# Altium project SolderingStation2024.PrjPcb
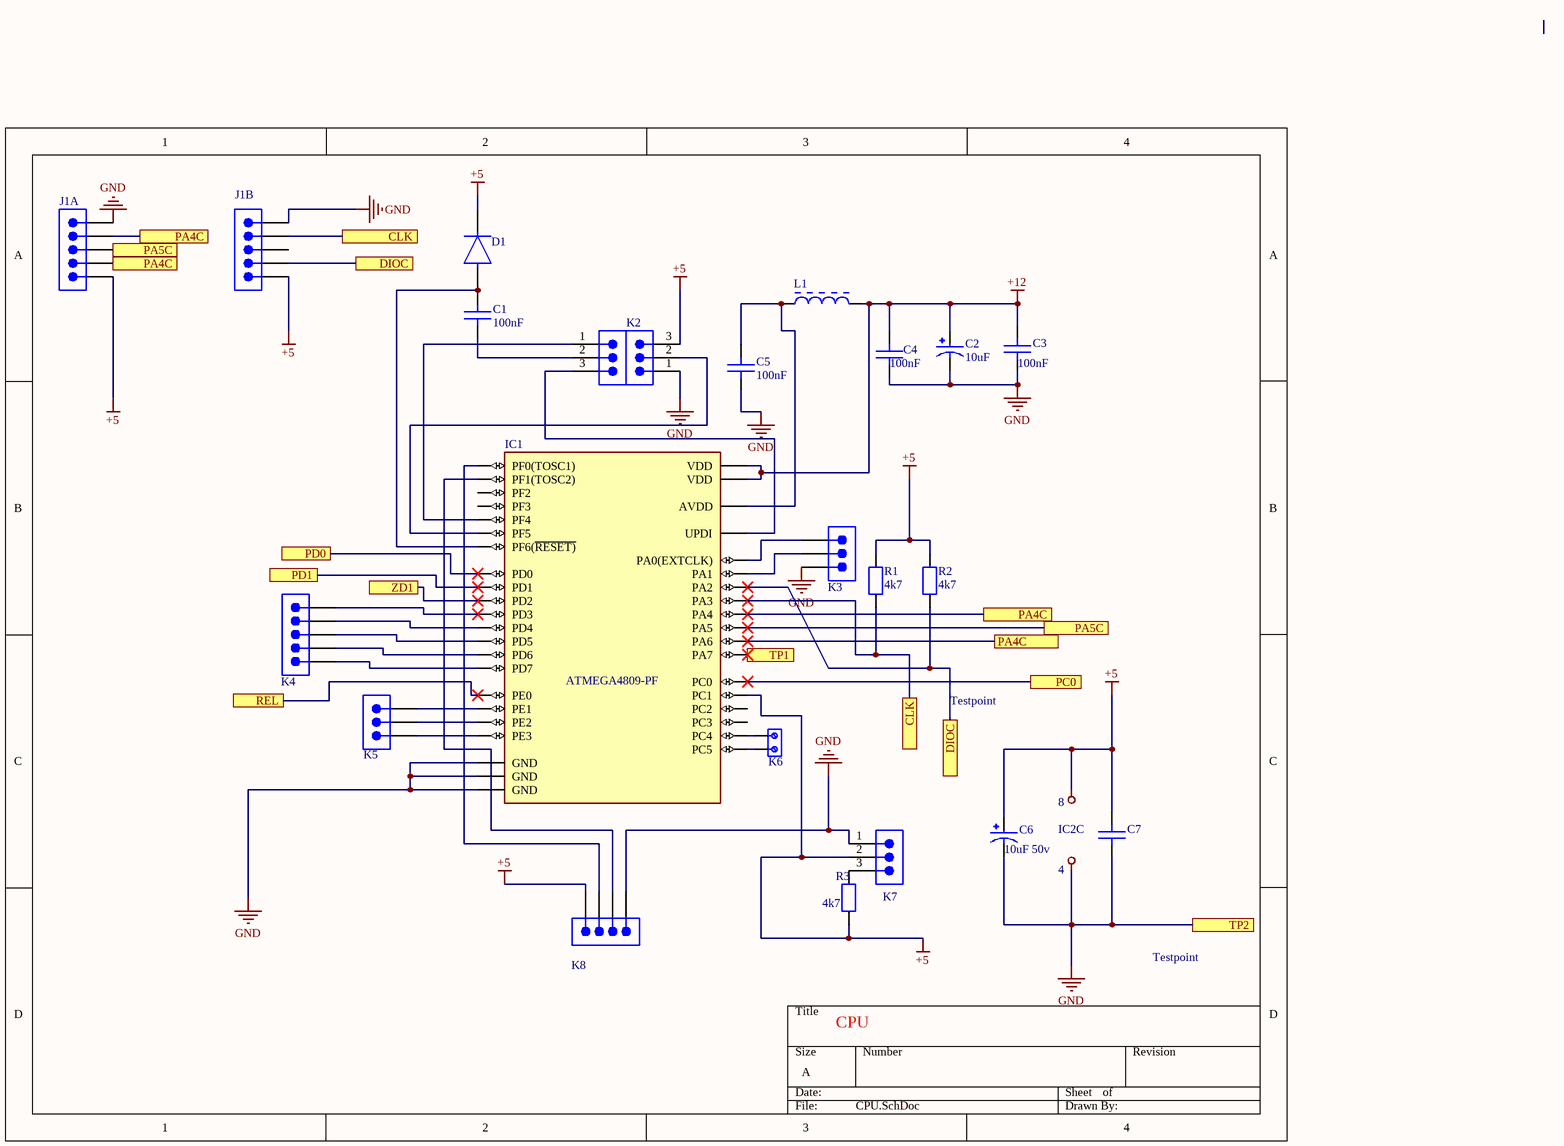
[diagram p0: CPU.SchDoc]
5 sheets, 83 parts. Net scope: flat (ports and power ports of the same name join across sheets).
Board file: PCB1.PcbDoc
Sheets:
  CPU.SchDoc
  PowerSupply.SchDoc
  Display.SchDoc
  PWU.SchDoc
  TermoCouple.SchDoc

## Sheet CPU.SchDoc
size A; SheetNumber: 1; SheetTotal: 5

### Parts
C1  100nF  [CAP_0805]
C2  10uF  [CAPPRD350W60D800H1150]
C3  100nF  [CAP_0805]
C4  100nF  [CAP_0805]
C5  100nF  [CAP_0805]
C6  10uF 50v  [CAPPRD500W50D500H1100]
C7  CAP_0805  [CAP_0805]  (value not drawn)
D1  1N4148WSF-7  [FP-SOD323F-MFG]  (value not drawn)
IC1  ATMEGA4809-PF  [FP-C04-016-MFG]
J1A  61300511121  [61300511121]  (value not drawn)
J1B  61300511121  [61300511121]  (value not drawn)
K1  61300311121  [61300311121]  (value not drawn)
K2  61300311121  [61300311121]  (value not drawn)
K3  61300311121  [61300311121]  (value not drawn)
K4  61300511121  [61300511121]  (value not drawn)
K5  61300311121  [61300311121]  (value not drawn)
K6  connecters 2pins  [conncecto 2 pins]  (value not drawn)
K7  61300311121  [61300311121]  (value not drawn)
K8  61300411121  [61300411121]  (value not drawn)
L1  RFB0807-103L  [COIL-RFB0807-2_V]  (value not drawn)
R1  4k7  [RES_0805]
R2  4k7  [RES_0805]
R3  4k7  [RES_0805]

### Ports
CLK, DIOC, PA4C, PA5C, PC0, PD0, PD1, REL, TP1, TP2, ZD1

### Nets
+5: C2.N C3.1 C4.1 C5.1 C6.N C6.P C7.1 C7.2 D1.1(C) IC1.2(PC1) IC1.6(GND) IC1.18(GND) IC1.32(GND) J1A.1 J1A.5 J1B.1 J1B.5 K2.1 K2.3 K3.1 K7.1 K7.2 K8.1 K8.4 R1.2 R2.2 R3.1 ; port TP2  [also labelled GND]
+12: C2.P C3.2 C4.2 IC1.5(VDD) IC1.31(VDD) L1.2
NetC1_1: C1.1 K1.2
NetC1_2: C1.2 D1.2(A) IC1.29(PF6(~{RESET)})
NetC5_2: C5.2 IC1.17(AVDD) L1.1
NetC16_1: IC1.9(PD0) ; port PD0
NetC18_2: IC1.10(PD1) ; port PD1
NetIC1_1: IC1.1(PC0) ; port PC0
NetIC1_7: IC1.7(PC4) K6.1
NetIC1_8: IC1.8(PC5) K6.2
NetIC1_11: IC1.11(PD2) ; port ZD1
NetIC1_12: IC1.12(PD3) K4.5
NetIC1_13: IC1.13(PD4) K4.4
NetIC1_14: IC1.14(PD5) K4.3
NetIC1_15: IC1.15(PD6) K4.2
NetIC1_16: IC1.16(PD7) K4.1
NetIC1_19: IC1.19(PE0) ; port REL
NetIC1_20: IC1.20(PE1) K5.1
NetIC1_21: IC1.21(PE2) K5.2
NetIC1_22: IC1.22(PE3) K5.3
NetIC1_23: IC1.23(PF0(TOSC1)) K8.3
NetIC1_24: IC1.24(PF1(TOSC2)) K8.2
NetIC1_27: IC1.27(PF4) K1.1
NetIC1_28: IC1.28(PF5) K2.2
NetIC1_30: IC1.30(UPDI) K1.3
NetIC1_33: IC1.33(PA0(EXTCLK)) K3.3
NetIC1_34: IC1.34(PA1) K3.2
NetIC1_35: IC1.35(PA2) J1B.2 R2.1 ; port DIOC
NetIC1_36: IC1.36(PA3) J1B.4 R1.1 ; port CLK
NetIC1_37: IC1.37(PA4) IC1.39(PA6) J1A.2 J1A.4 ; port PA4C
NetIC1_38: IC1.38(PA5) J1A.3 ; port PA5C
NetIC1_40: IC1.40(PA7) ; port TP1
NetK7_3: K7.3 R3.2

Not connected (* = marked no-connect by the designer): IC1 3(PC2) 4(PC3) 25(PF2) 26(PF3); J1B 3

### Notes on the sheet
- Testpoint
- 8
- (near C7) IC2C
- 4
- CPU

### Library data of the parts
C1 C3-C5 C7 = CAP_0805: Capacitor SMD 0805 generic.; Manufacturer: *; Manufacture Part N: *; Tolerence: *; Voltage Rating: *; Dielectric: *
C2 = Capacitor: Capacitor 100 μF, 50 V, steek 3,5 mm, 8x11 mm, generic.
C6 = Capacitor_1: Capacitor, 10 μF, 50 V, steek 2 mm, 5x11 mm, generic.
D1 = 1N4148WSF-7: Rectifier Diode, 1 Phase, 1 Element, 0.25A, 100V V(RRM), Silicon; Manufacturer: Diodes; Package Body Material: Plastic; Number of Elements: 1; Max Output current: 250mA; Max Power Dissipation: 400mW; Reverse Recovery Time-Max: 0.004us; Supplier: Future Electronics; Supplier Part Number: 4050038; Manufacturer Part Number: 1N4148WSF-7; RoHS: Yes; Category: Rectifier Diodes; Stock: 36000; Pricing: 3000=0.0178, 12000=0.0171, 45000=0.0164, 90000=0.0161, 225000=0.0153 (USD); Pins: 2; Diode Element Material: SILICON; Package Shape: Rectangular; Terminal Finish: Tin; Min Operating Temperature: -55°C; Max Operating Temperature: 150°C; JESD-609 Code: e3; Diode Type: RECTIFIER; JESD-30 Code: R-PDSO-F2; Package Style: SMALL OUTLINEMeter; Rep Pk Reverse Voltage-Max: 100V; Surface Mount: Yes; Terminal Form: Flat; Terminal Position: DUAL; Reach SVHC Compliant: Yes; RoHS Compliant: Yes; ComponentLink1URL: https://datasheet.ciiva.com:443/pdfs/VipMasterIC/IC/DIOD/DIODS20288/DIODS20288-1.pdf?src-supplier=IHS+Markit; ComponentLink1Description: https://datasheet.ciiva.com:443/pdfs/VipMasterIC/IC/DIOD/DIODS20288/DIODS20288-1.pdf?src-supplier=IHS+Markit; ComponentLink2URL: https://datasheet.ciiva.com/29592/1n4148wsf-29592065.pdf?src-supplier=Digikey; ComponentLink2Description: https://datasheet.ciiva.com/29592/1n4148wsf-29592065.pdf?src-supplier=Digikey
J1A J1B K4 = 61300511121: Board Connector, 5 Contact(s), 1 Row(s), Male, Straight, 0.1 inch Pitch, Solder Terminal, Locking, Black Insulator, Plug; Manufacturer: Wurth Electronics; Contact Pattern: RECTANGULAR; Contact Resistance: 20mR; Contact Style: SQ PIN-SKT; Dielectric Withstanding Voltage (AC): 500V; Insulation Resistance: 1GR; Number Of Connectors: 1; Rated Current (Signal): 3A; Number of Contacts: 5; Body Length: 0.5inch; Reference Standard: UL; Reliability: COMMERCIAL; Supplier: Rs; Supplier Part Number: 8281597P; Manufacturer Part Number: 61300511121; RoHS: Yes; Category: Headers and Wire Housings; Stock: 1085; Pricing: 125=0.136, 500=0.116, 2500=0.11, 5000=0.102 (EUR); Mounting Technology: Board; Contact Material: Copper Alloy; Contact Finish - Mating: GOLD; Contact Finish - Termination: Gold (Au) - with Nickel (Ni) barrier; Insulation Color: Black; Insulation Material: Polybutylene; Min Operating Temperature: -40°C; Max Operating Temperature: 125°C; Connector Type: BOARD CONNECTOR; JESD-609 Code: e4; Body/Shell Style: PLUG; Contact Gender: Male; Mounting Style: STRAIGHT; Number of Rows Loaded: 1; PCB Contact Pattern: RECTANGULAR; Termination: Solder; Body Breadth: 0.1inch; Body Depth: 0.1inch; Mating Contact Pitch: 0.1inch; Mounting Option 1: LOCKING; Terminal Length: 0.118inch; Terminal Pitch: 2.54mm; Reach SVHC Compliant: Yes; RoHS Compliant: Yes; ComponentLink1URL: https://datasheet.ciiva.com:443/pdfs/VipMasterIC/IC/MIDC/MIDCS07676/MIDCS07676-1.pdf?src-supplier=IHS+Markit; ComponentLink1Description: https://datasheet.ciiva.com:443/pdfs/VipMasterIC/IC/MIDC/MIDCS07676/MIDCS07676-1.pdf?src-supplier=IHS+Markit; ComponentLink2URL: http://www.farnell.com/cad/1737268.pdf?src-supplier=Element14; ComponentLink2Description: http://www.farnell.com/cad/1737268.pdf?src-supplier=Element14; ComponentLink3URL: https://datasheet.octopart.com/61300511121-W%C3%BCrth-Elektronik-datasheet-21154836.pdf?src-supplier=Element14; ComponentLink3Description: https://datasheet.octopart.com/61300511121-W%C3%BCrth-Elektronik-datasheet-21154836.pdf?src-supplier=Element14; ComponentLink4URL: https://katalog.we-online.de/em/datasheet/6130xx11121.pdf?src-supplier=Digikey; ComponentLink4Description: https://katalog.we-online.de/em/datasheet/6130xx11121.pdf?src-supplier=Digikey
K1-K3 K5 K7 = 61300311121: Board Connector, 3 Contact(s), 1 Row(s), Male, Straight, 0.1 inch Pitch, Solder Terminal, Locking, Black Insulator, Plug; Manufacturer: Wurth Electronics; Contact Pattern: RECTANGULAR; Contact Resistance: 20mR; Contact Style: SQ PIN-SKT; Dielectric Withstanding Voltage (AC): 500V; Insulation Resistance: 1GR; Number Of Connectors: 1; Rated Current (Signal): 3A; Number of Contacts: 3; Body Length: 0.3inch; Reference Standard: UL; Reliability: COMMERCIAL; Supplier: Rs; Supplier Part Number: 8281585P; Manufacturer Part Number: 61300311121; RoHS: Yes; Category: Connectors; Stock: 3960; Pricing: 25=0.11, 50=0.088, 100=0.082, 250=0.078 (EUR); Mounting Technology: Board; Contact Material: Copper Alloy; Contact Finish - Mating: GOLD; Contact Finish - Termination: Gold (Au) - with Nickel (Ni) barrier; Insulation Color: Black; Insulation Material: Polybutylene; Min Operating Temperature: -40°C; Max Operating Temperature: 125°C; Connector Type: BOARD CONNECTOR; JESD-609 Code: e4; Body/Shell Style: PLUG; Contact Gender: Male; Mounting Style: STRAIGHT; Number of Rows Loaded: 1; PCB Contact Pattern: RECTANGULAR; Termination: Solder; Body Breadth: 0.1inch; Body Depth: 0.1inch; Mating Contact Pitch: 0.1inch; Mounting Option 1: LOCKING; Terminal Length: 0.118inch; Terminal Pitch: 2.54mm; Reach SVHC Compliant: Yes; RoHS Compliant: Yes; ComponentLink1URL: https://datasheet.ciiva.com:443/pdfs/VipMasterIC/IC/MIDC/MIDCS07676/MIDCS07676-1.pdf?src-supplier=IHS+Markit; ComponentLink1Description: https://datasheet.ciiva.com:443/pdfs/VipMasterIC/IC/MIDC/MIDCS07676/MIDCS07676-1.pdf?src-supplier=IHS+Markit; ComponentLink2URL: http://www.farnell.com/cad/1737268.pdf?src-supplier=Element14; ComponentLink2Description: http://www.farnell.com/cad/1737268.pdf?src-supplier=Element14; ComponentLink3URL: https://datasheet.octopart.com/61300311121-W%C3%BCrth-Elektronik-datasheet-21154836.pdf?src-supplier=Element14; ComponentLink3Description: https://datasheet.octopart.com/61300311121-W%C3%BCrth-Elektronik-datasheet-21154836.pdf?src-supplier=Element14; ComponentLink4URL: https://katalog.we-online.de/em/datasheet/6130xx11121.pdf?src-supplier=Digikey; ComponentLink4Description: https://katalog.we-online.de/em/datasheet/6130xx11121.pdf?src-supplier=Digikey
K6 = pins: printkroonsteen 5,08 mm,
K8 = 61300411121: Board Connector, 4 Contact(s), 1 Row(s), Male, Straight, 0.1 inch Pitch, Solder Terminal, Locking, Black Insulator, Plug; Manufacturer: Wurth Electronics; Contact Pattern: RECTANGULAR; Contact Resistance: 20mR; Contact Style: SQ PIN-SKT; Dielectric Withstanding Voltage (AC): 500V; Insulation Resistance: 1GR; Number Of Connectors: 1; Rated Current (Signal): 3A; Number of Contacts: 4; Body Length: 0.4inch; Reference Standard: UL; Reliability: COMMERCIAL; Supplier: Rs; Supplier Part Number: 8281594P; Manufacturer Part Number: 61300411121; RoHS: Yes; Category: Headers and Wire Housings; Stock: 2615; Pricing: 250=0.076, 500=0.074, 2500=0.072, 5000=0.07 (EUR); Mounting Technology: Board; Contact Material: Copper Alloy; Contact Finish - Mating: GOLD; Contact Finish - Termination: Gold (Au) - with Nickel (Ni) barrier; Insulation Color: Black; Insulation Material: Polybutylene; Min Operating Temperature: -40°C; Max Operating Temperature: 125°C; Connector Type: BOARD CONNECTOR; JESD-609 Code: e4; Body/Shell Style: PLUG; Contact Gender: Male; Mounting Style: STRAIGHT; Number of Rows Loaded: 1; PCB Contact Pattern: RECTANGULAR; Termination: Solder; Body Breadth: 0.1inch; Body Depth: 0.1inch; Mating Contact Pitch: 0.1inch; Mounting Option 1: LOCKING; Terminal Length: 0.118inch; Terminal Pitch: 2.54mm; Reach SVHC Compliant: Yes; RoHS Compliant: Yes; ComponentLink1URL: https://datasheet.ciiva.com:443/pdfs/VipMasterIC/IC/MIDC/MIDCS07676/MIDCS07676-1.pdf?src-supplier=IHS+Markit; ComponentLink1Description: https://datasheet.ciiva.com:443/pdfs/VipMasterIC/IC/MIDC/MIDCS07676/MIDCS07676-1.pdf?src-supplier=IHS+Markit; ComponentLink2URL: http://www.farnell.com/cad/1737268.pdf?src-supplier=Element14; ComponentLink2Description: http://www.farnell.com/cad/1737268.pdf?src-supplier=Element14; ComponentLink3URL: https://datasheet.octopart.com/61300411121-W%C3%BCrth-Elektronik-datasheet-21154836.pdf?src-supplier=Element14; ComponentLink3Description: https://datasheet.octopart.com/61300411121-W%C3%BCrth-Elektronik-datasheet-21154836.pdf?src-supplier=Element14; ComponentLink4URL: https://katalog.we-online.de/em/datasheet/6130xx11121.pdf?src-supplier=Digikey; ComponentLink4Description: https://katalog.we-online.de/em/datasheet/6130xx11121.pdf?src-supplier=Digikey
L1 = RFB0807-103L: General Purpose Inductor, 10000uH, 10%, 1 Element, Ferrite-Core; Manufacturer: Coilcraft; Manufacturer Series: RFB; DC Resistance (DCR): 34R; Inductor Application: POWER INDUCTOR; Channels: 1; Max Current Rating: 100mA; Self Resonant Frequency: 700kHz; Shape/Size Description: CYLINDRICAL PACKAGE; Shielding: Unshielded; Surface Mount: No; Test Frequency: 100kHz; Lead Diameter: 0.6mm; Lead Length: 4mm; Package Diameter: 8.8mm; Package Length: 7.5mm; Reference Standard: AEC-Q200; Supplier: Mouser; Supplier Part Number: 994-RFB0807-103L; Manufacturer Part Number: RFB0807-103L; RoHS: Yes; Category: Fixed Inductors; Stock: 337; Pricing: 1=1.46, 10=1.46, 50=1.46, 100=1.46, 1000=0.714, 10000=0.664 (USD); Pins: 2; Core Material: Ferrite; Terminal Finish: Tin; Min Operating Temperature: -40°C; Max Operating Temperature: 85°C; Tolerance: 10%; JESD-609 Code: e2; Construction: Cylindrical; Inductance-Nom (L): 10000uH; Inductor Type: GENERAL PURPOSE INDUCTOR; Package Style: RadialMeter; Packaging: Tray; Series: RFB; Terminal Placement: Radial; Termination: Wire; Lead Pitch: 5mm; Reach SVHC Compliant: Yes; RoHS Compliant: Yes; ComponentLink1URL: https://datasheet.ciiva.com:443/pdfs/VipMasterIC/IC/COLC/COLC-S-A0001039031/COLC-S-A0000243710-1.pdf?src-supplier=IHS+Markit; ComponentLink1Description: https://datasheet.ciiva.com:443/pdfs/VipMasterIC/IC/COLC/COLC-S-A0001039031/COLC-S-A0000243710-1.pdf?src-supplier=IHS+Markit; ComponentLink2URL: http://www.farnell.com/datasheets/1870388.pdf?src-supplier=Farnell; ComponentLink2Description: http://www.farnell.com/datasheets/1870388.pdf?src-supplier=Farnell; ComponentLink3URL: http://www.farnell.com/datasheets/1870388.pdf?src-supplier=Element14; ComponentLink3Description: http://www.farnell.com/datasheets/1870388.pdf?src-supplier=Element14
R1-R3 = RES_0805: SMD size 0805 Generic.; Manufacturer: *; Manufacture Part N: *; Tolerence: *; Package Size: *; Voltage Rating: *

## Sheet PowerSupply.SchDoc
size A; SheetNumber: 2; SheetTotal: 5
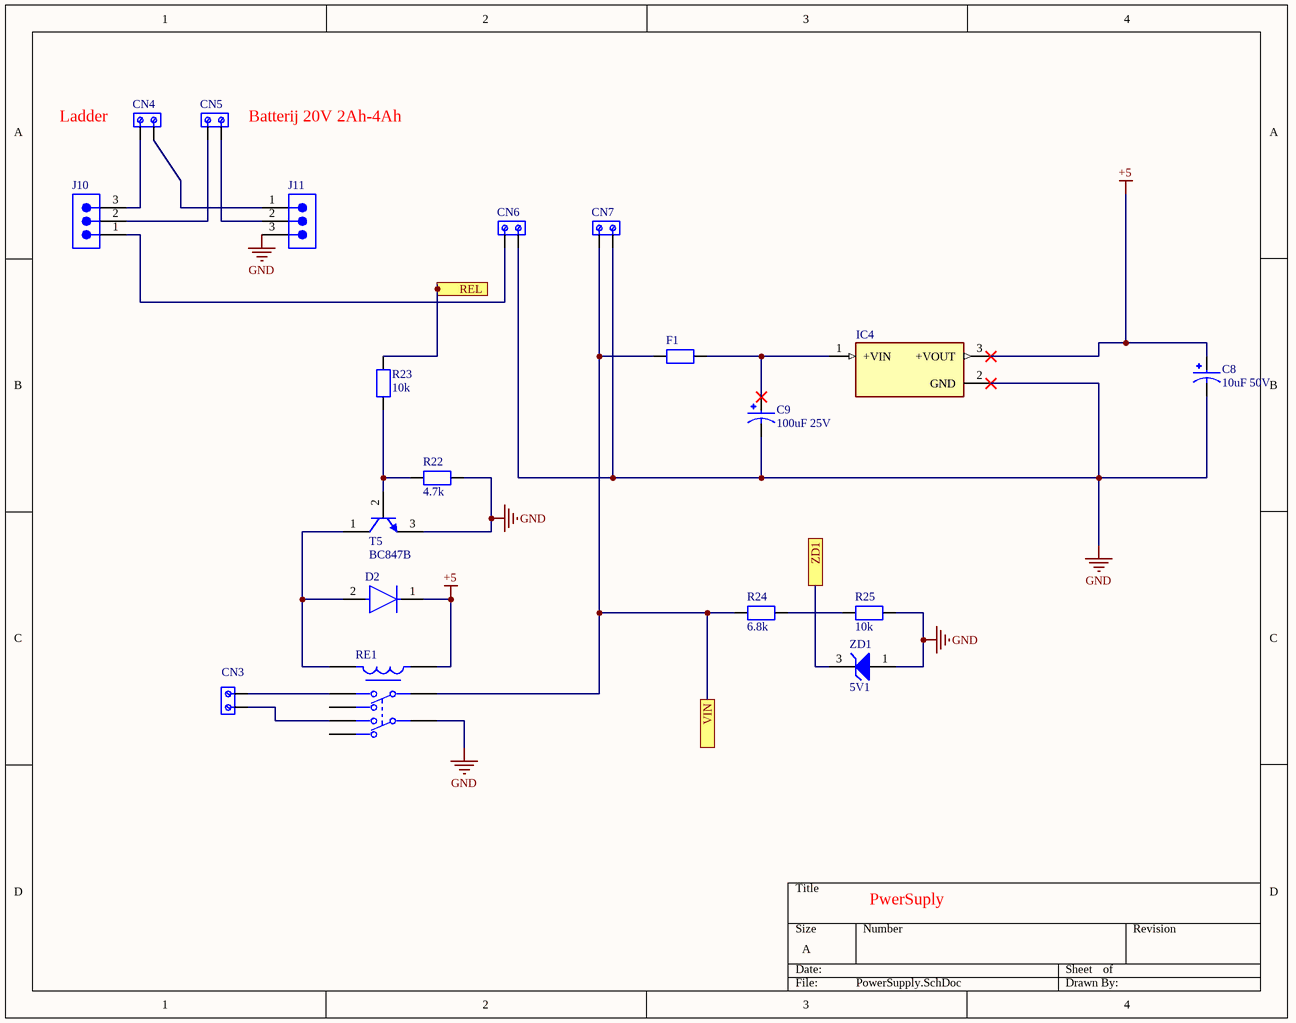
[diagram p1: PowerSupply.SchDoc]

### Parts
C8  10uF 50V  [CAPPRD350W60D800H1150]
C9  100uF 25V  [CAPPRD500W50D500H1100]
CN3  connecters 2pins  [conncecto 2 pins]  (value not drawn)
CN4  connecters 2pins  [conncecto 2 pins]  (value not drawn)
CN5  connecters 2pins  [conncecto 2 pins]  (value not drawn)
CN6  connecters 2pins  [conncecto 2 pins]  (value not drawn)
CN7  connecters 2pins  [conncecto 2 pins]  (value not drawn)
D2  1N4007  [FP-SOD323F-MFG]  (value not drawn)
F1  RES_0805  [RES_0805]  (value not drawn)
IC4  DC/DC converters  [CONV_TSR_1-2450E]  (value not drawn)
J10  61300311121  [61300311121]  (value not drawn)
J11  61300311121  [61300311121]  (value not drawn)
R22  4.7k  [RES_0805]
R23  10k  [RES_0805]
R24  6.8k  [RES_0805]
R25  10k  [RES_0805]
RE1  RT424005F  [FP-RT424005F-MFG]  (value not drawn)
T5  BC847B  [ONSC-TO-92-3-29-11]
ZD1  5V1  [ONSC-SOT-23-3-318-08_V]

### Ports
REL (see CPU[1C]), VIN (see PWU[2B]), ZD1 (see CPU[2B])

### Nets
+5: C8.N C8.P C9.N CN6.2 CN7.2 D2.1(C) IC4.2(GND) IC4.3(+VOUT) J11.3 R22.2 R25.2 RE1.21 RE1.A1 T5.3(E) ZD1.1(A)  [also labelled GND]
NetC9_P: C9.P F1.2 IC4.1(+VIN)
NetCN3_1: CN3.1 RE1.24
NetCN3_2: CN3.2 RE1.14
NetCN4_1: CN4.1 J10.3
NetCN4_2: CN4.2 J11.1
NetCN5_1: CN5.1 J10.2
NetCN5_2: CN5.2 J11.2
NetCN6_1: CN6.1 J10.1
NetCN7_1: CN7.1 F1.1 R24.1 RE1.11 ; port VIN
NetD2_2: D2.2(A) RE1.A2 T5.1(C)
NetIC1_11: ZD1.3(K) ; port ZD1
NetIC1_19: R23.2 ; port REL
NetR22_1: R22.1 R23.1 T5.2(B)
NetR24_2: R24.2 R25.1

Not connected (* = marked no-connect by the designer): RE1 12 22

### Notes on the sheet
- (near CN4) Ladder
- (near CN5) Batterij 20V 2Ah-4Ah
- PwerSuply

### Library data of the parts
C8 = Capacitor: as C2 on sheet CPU
C9 = Capacitor_1: as C6 on sheet CPU
CN3-CN7 = pins: printkroonsteen 5,08 mm,
D2 = 1N4148WSF-7: as D1 on sheet CPU; Supplier: Future Electronics; Supplier Part Number: 4050038; Manufacturer Part Number: 1N4148WSF-7; RoHS: Yes; Category: Rectifier Diodes; Stock: 36000; Pricing: 3000=0.0178, 12000=0.0171, 45000=0.0164, 90000=0.0161, 225000=0.0153 (USD); Pins: 2; Diode Element Material: SILICON; Package Shape: Rectangular; Terminal Finish: Tin; Min Operating Temperature: -55°C; Max Operating Temperature: 150°C; JESD-609 Code: e3; Diode Type: RECTIFIER; JESD-30 Code: R-PDSO-F2; Package Style: SMALL OUTLINEMeter; Rep Pk Reverse Voltage-Max: 100V; Surface Mount: Yes; Terminal Form: Flat; Terminal Position: DUAL; Reach SVHC Compliant: Yes; RoHS Compliant: Yes; ComponentLink1URL: https://datasheet.ciiva.com:443/pdfs/VipMasterIC/IC/DIOD/DIODS20288/DIODS20288-1.pdf?src-supplier=IHS+Markit; ComponentLink1Description: https://datasheet.ciiva.com:443/pdfs/VipMasterIC/IC/DIOD/DIODS20288/DIODS20288-1.pdf?src-supplier=IHS+Markit; ComponentLink2URL: https://datasheet.ciiva.com/29592/1n4148wsf-29592065.pdf?src-supplier=Digikey; ComponentLink2Description: https://datasheet.ciiva.com/29592/1n4148wsf-29592065.pdf?src-supplier=Digikey
F1 R22-R25 = RES_0805: SMD size 0805 Generic.; Manufacturer: *; Manufacture Part N: *; Tolerence: *; Package Size: *; Voltage Rating: *
J10 J11 = 61300311121: as K1 on sheet CPU; Supplier: Rs; Supplier Part Number: 8281585P; Manufacturer Part Number: 61300311121; RoHS: Yes; Category: Connectors; Stock: 3960; Pricing: 25=0.11, 50=0.088, 100=0.082, 250=0.078 (EUR); Mounting Technology: Board; Contact Material: Copper Alloy; Contact Finish - Mating: GOLD; Contact Finish - Termination: Gold (Au) - with Nickel (Ni) barrier; Insulation Color: Black; Insulation Material: Polybutylene; Min Operating Temperature: -40°C; Max Operating Temperature: 125°C; Connector Type: BOARD CONNECTOR; JESD-609 Code: e4; Body/Shell Style: PLUG; Contact Gender: Male; Mounting Style: STRAIGHT; Number of Rows Loaded: 1; PCB Contact Pattern: RECTANGULAR; Termination: Solder; Body Breadth: 0.1inch; Body Depth: 0.1inch; Mating Contact Pitch: 0.1inch; Mounting Option 1: LOCKING; Terminal Length: 0.118inch; Terminal Pitch: 2.54mm; Reach SVHC Compliant: Yes; RoHS Compliant: Yes; ComponentLink1URL: https://datasheet.ciiva.com:443/pdfs/VipMasterIC/IC/MIDC/MIDCS07676/MIDCS07676-1.pdf?src-supplier=IHS+Markit; ComponentLink1Description: https://datasheet.ciiva.com:443/pdfs/VipMasterIC/IC/MIDC/MIDCS07676/MIDCS07676-1.pdf?src-supplier=IHS+Markit; ComponentLink2URL: http://www.farnell.com/cad/1737268.pdf?src-supplier=Element14; ComponentLink2Description: http://www.farnell.com/cad/1737268.pdf?src-supplier=Element14; ComponentLink3URL: https://datasheet.octopart.com/61300311121-W%C3%BCrth-Elektronik-datasheet-21154836.pdf?src-supplier=Element14; ComponentLink3Description: https://datasheet.octopart.com/61300311121-W%C3%BCrth-Elektronik-datasheet-21154836.pdf?src-supplier=Element14; ComponentLink4URL: https://katalog.we-online.de/em/datasheet/6130xx11121.pdf?src-supplier=Digikey; ComponentLink4Description: https://katalog.we-online.de/em/datasheet/6130xx11121.pdf?src-supplier=Digikey
RE1 = RT424005F: Power/Signal Relay, 2 Form C, DPDT, Momentary, 0.08A (Coil), 5VDC (Coil), 400mW (Coil), 8A (Contact), 30VDC (Contact), DC Input, Random, AC Output, Through Hole-Straight Mount; Manufacturer: TE Connectivity; End Contact Material: Agni90/10; Coil Current(DC)-Max: 80mA; Coil Operate Voltage(DC): 3.5V; Coil Release Voltage(DC): 500mV; Coil Resistance: 62R; Coil Voltage(DC)-Max: 5V; Contact AC Max Power Rating R Load: 2000VA@400VAC; Contact AC Max Rating R Load: 8A@250VAC; Contact DC Max Rating R Load: 8A@30VDC; Contact Voltage(AC)-Max: 250V; Contact Voltage(DC)-Max: 30V; Dielectric Strength Between Coil and Contacts: 5000Vrms; Dielectric Strength Between Open Contacts: 1000Vrms; Electrical Life: 30000Cycles; Operate Time: 15ms; PCB Hole Count: 8; Relay Form: 2 FORM C; Release Time: 6ms; Body Breadth: 12.7inch; Body Height: 15.7mm; Body Length or Diameter: 29mm; Reference Standard: UL; Sealing: FLUX FREE SEALED; Supplier: Avnet; Supplier Part Number: 17C6452; Manufacturer Part Number: RT424005F; RoHS: Yes; Category: Power Relays; Stock: 1500; Pricing: 1=6.31, 10=5.95, 25=5.33, 50=5.1, 100=4.86 (USD); Mounting Technology: Through Hole; Pins: 8; Weight: 13g; Min Operating Temperature: -40°C; Max Operating Temperature: 85°C; Coil Power: 400mW; Coil Voltage-Nom: 5V; Coil/Input Supply Type: DC; Contact Current(AC)-Max: 8A; Contact Current(DC)-Max: 8A; Contact/Output Supply Type: AC; Input Switching Control Type: Random; Packaging: Box; Relay Action: MOMENTARY; Relay Function: DPDT; Relay Type: POWER/SIGNAL RELAY; Termination: Solder; Terminal Length: 0.0036inch; Reach SVHC Compliant: Yes; RoHS Compliant: Yes; ComponentLink1URL: https://datasheet.ciiva.com:443/pdfs/VipMasterIC/IC/TYEL/TYEL-S-A0008743874/TYEL-S-A0008744021-1.pdf?src-supplier=IHS+Markit; ComponentLink1Description: https://datasheet.ciiva.com:443/pdfs/VipMasterIC/IC/TYEL/TYEL-S-A0008743874/TYEL-S-A0008744021-1.pdf?src-supplier=IHS+Markit; ComponentLink2URL: https://datasheet.ciiva.com/2408/eng-ds-rt2pb-0411-2408708.pdf?src-supplier=Digikey; ComponentLink2Description: https://datasheet.ciiva.com/2408/eng-ds-rt2pb-0411-2408708.pdf?src-supplier=Digikey
T5 = BC547CG: Small Signal Bipolar Transistor, 0.1A I(C), 45V V(BR)CEO, 1-Element, NPN, Silicon, TO-92; Manufacturer: ON Semiconductor; Package Body Material: Plastic; Max Collector Current: 100mA; DC Current Gain-Min (hFE): 420; Number of Elements: 1; Power Dissipation-Max (Abs): 625mW; Surface Mount: No; Time @ Peak Reflow Temperature-Max (s): 40s; Transistor Application: AMPLIFIER; Frequency: 300MHz; Qualification Status: Not Qualified; Supplier: Arrow Electronics; Supplier Part Number: BC547CG; Manufacturer Part Number: BC547CG; RoHS: Yes; Category: BJTs; Stock: 41483; Pricing: 1=0.214, 25=0.189, 100=0.169, 500=0.16, 1000=0.107, 2500=0.092, 5000=0.08, 10000=0.064, 25000=0.062 (USD); Pins: 3; Package Shape: Round; Terminal Finish: Copper; Transistor Element Material: SILICON; Max Operating Temperature: 150°C; JESD-609 Code: e1; Polarity/Channel Type: NPN; Collector-emitter Voltage-Max: 45V; JESD-30 Code: O-PBCY-T3; Package Style: CYLINDRICALMeter; Peak Reflow Temperature (Cel): 260°C; Terminal Form: Through Hole; Terminal Position: BOTTOM; RoHS Compliant: Yes; Reach SVHC Compliant: Yes; JEDEC-95 Code: TO-92; ComponentLink1URL: https://datasheet.ciiva.com:443/pdfs/VipMasterIC/IC/ONSM/ONSMS24464/ONSMS24464-1.pdf?src-supplier=IHS+Markit; ComponentLink1Description: https://datasheet.ciiva.com:443/pdfs/VipMasterIC/IC/ONSM/ONSMS24464/ONSMS24464-1.pdf?src-supplier=IHS+Markit; ComponentLink2URL: https://datasheet.ciiva.com/977/bc546-d-977051.pdf?src-supplier=Digikey; ComponentLink2Description: https://datasheet.ciiva.com/977/bc546-d-977051.pdf?src-supplier=Digikey
ZD1 = MMBZ5231BLT1G: Zener Diode, 5.1V V(Z), 5.1%, 0.225W, Silicon, Unidirectional, TO-236AB; Manufacturer: ON Semiconductor; Package Body Material: Plastic; Dynamic Impedance-Max: 17R; Number of Elements: 1; Max Power Dissipation: 225mW; Test Current: 20mA; Time @ Peak Reflow Temperature-Max (s): 40s; Qualification Status: Not Qualified; Supplier: Future Electronics; Supplier Part Number: 8481582; Manufacturer Part Number: MMBZ5231BLT1G; RoHS: Yes; Category: Zener Diodes; Stock: 543000; Pricing: 3000=0.014, 12000=0.0134, 30000=0.013, 75000=0.0127, 120000=0.0121 (USD); Pins: 3; Terminal Finish: Tin; Diode Element Material: SILICON; Package Shape: Rectangular; Min Operating Temperature: -65°C; Max Operating Temperature: 150°C; JESD-609 Code: e3; Diode Type: ZENER; Reference Voltage-Nom: 5.1V; Surface Mount: Yes; Voltage Tol-Max: 5.1%; Polarity: Unidirectional; Moisture Sensitivity Level: 1; Package Style: SMALL OUTLINEMeter; Technology: ZENER; Terminal Form: Gull Wing; Terminal Position: DUAL; JESD-30 Code: R-PDSO-G3; Peak Reflow Temperature (Cel): 260°C; Reach SVHC Compliant: Yes; RoHS Compliant: Yes; JEDEC-95 Code: TO-236AB; ComponentLink1URL: https://datasheet.ciiva.com:443/pdfs/VipMasterIC/IC/ONSM/ONSM-S-A0002808860/ONSM-S-A0002808860-1.pdf?src-supplier=IHS+Markit; ComponentLink1Description: https://datasheet.ciiva.com:443/pdfs/VipMasterIC/IC/ONSM/ONSM-S-A0002808860/ONSM-S-A0002808860-1.pdf?src-supplier=IHS+Markit

## Sheet Display.SchDoc
size A; SheetNumber: 3; SheetTotal: 5
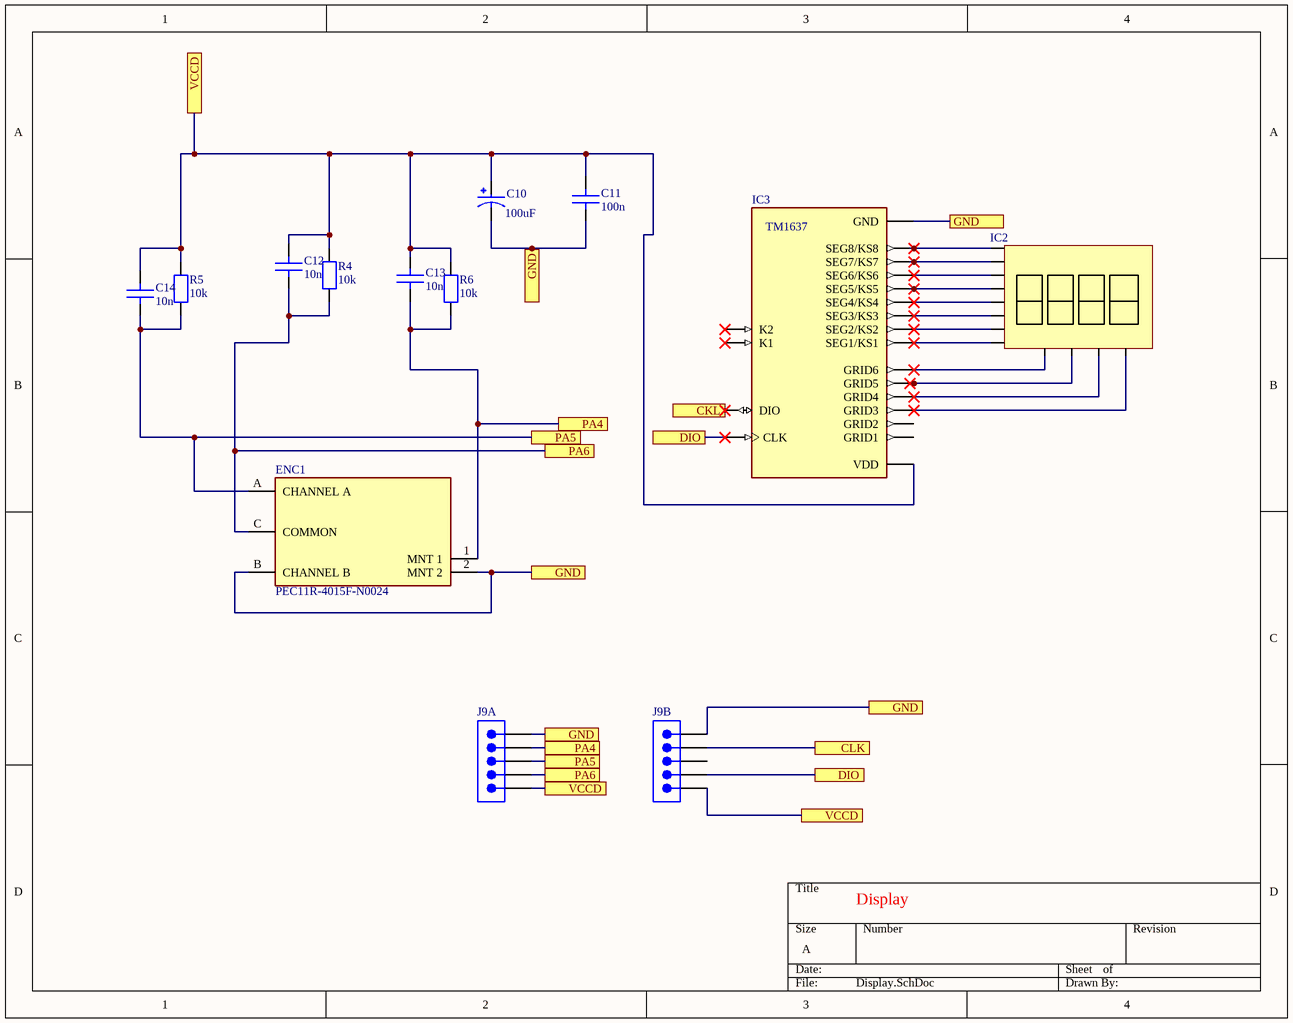
[diagram p2: Display.SchDoc]

### Parts
C10  100uF  [CAPPRD350W60D800H1150]
C11  100n  [CAP_0805]
C12  10n  [CAP_0805]
C13  10n  [CAP_0805]
C14  10n  [CAP_0805]
ENC1  PEC11R-4015F-N0024  [FP-PEC11R-4015F-N0024-MFG]
IC2  KW4-801AVB  [LTC46454G]  (value not drawn)
IC3  TM1637  [DIP778W43P254L2612H431Q20N]
J9A  61300511121  [61300511121]  (value not drawn)
J9B  61300511121  [61300511121]  (value not drawn)
R4  10k  [RES_0805]
R5  10k  [RES_0805]
R6  10k  [RES_0805]

### Ports
CKL, CLK, DIO, DIO (see Display[3B]), GND, PA4, PA5, PA6, VCCD, VCCD (see Display[1A], Display[2D]), VCCD (see Display[2D], Display[3D])

### Nets
NetC10_N: C10.N C11.1 ENC1.2(MNT_2) ENC1.B(CHANNEL_B) IC3.1(GND) J9A.5 J9B.5 ; port GND
NetC10_P: C10.P C11.2 C12.2 C13.1 C14.2 IC3.16(VDD) J9A.1 J9B.1 R4.1 R5.2 R6.2 ; port VCCD
NetC12_1: C12.1 ENC1.C(COMMON) J9A.2 R4.2 ; port PA6
NetC13_2: C13.2 ENC1.1(MNT_1) J9A.4 R6.1 ; port PA4
NetC14_1: C14.1 ENC1.A(CHANNEL_A) J9A.3 R5.1 ; port PA5
NetIC1_36: J9B.4 ; port CLK
NetIC3_17: IC3.17(DIO) ; port CKL
NetIC3_18: IC3.18(CLK) J9B.2 ; port DIO

Not connected (* = marked no-connect by the designer): IC3 2(SEG1/KS1)* 3(SEG2/KS2)* 4(SEG3/KS3)* 5(SEG4/KS4)* 6(SEG5/KS5)* 7(SEG6/KS6)* 8(SEG7/KS7)* 9(SEG8/KS8)* 10(GRID6)* 11(GRID5)* 12(GRID4)* 13(GRID3)* 14(GRID2) 15(GRID1) 19(K1)* 20(K2)*; J9B 3

### Notes on the sheet
- Display

### Library data of the parts
C10 = Capacitor: as C2 on sheet CPU
C11-C14 = CAP_0805: Capacitor SMD 0805 generic.; Manufacturer: *; Manufacture Part N: *; Tolerence: *; Voltage Rating: *; Dielectric: *
ENC1 = CMP-07421-000003-1: ROTARY ENCODER MECHANICAL 24PPR; Manufacturer: Bourns; Current Rating: 10mA; Number Of Circuits: 1; Conn Orientation: Vertical; Encoder Type: Incremental; Detent: No; Pulses Per Rev: 24; Voltage Rating Dc: 5V; Manufacturer Part Number: PEC11R-4015F-N0024; Height: 22.3mm; ComponentLink2URL: https://www.bourns.com/docs/product-datasheets/pec11r.pdf?sfvrsn=bb617cbf_7; Mouser Description: Encoders 15mm SHAFT NO SWITCH; Package: 0; RoHS: TRUE; Temperature Range High: +70°C; Device Class L1: Electromechanical; Device Class L3: Encoders; Temperature Range Low: -30°C; Device Class L2: Switches; Temperature: -30°C to +70°C; Category: Enc; ComponentLink2Description: Datasheet; Lead Free: Yes; Automotive: No; Octopart: https://octopart.com/pec11r-4015f-n0024-bourns-26648251; Digikey Description: ROTARY ENCODER MECHANICAL 24PPR
IC2 = KW4-801AVB: SEVEN_SEG Diplay 4digits
J9A J9B = 61300511121: as J1A on sheet CPU; Supplier: Rs; Supplier Part Number: 8281597P; Manufacturer Part Number: 61300511121; RoHS: Yes; Category: Headers and Wire Housings; Stock: 1085; Pricing: 125=0.136, 500=0.116, 2500=0.11, 5000=0.102 (EUR); Mounting Technology: Board; Contact Material: Copper Alloy; Contact Finish - Mating: GOLD; Contact Finish - Termination: Gold (Au) - with Nickel (Ni) barrier; Insulation Color: Black; Insulation Material: Polybutylene; Min Operating Temperature: -40°C; Max Operating Temperature: 125°C; Connector Type: BOARD CONNECTOR; JESD-609 Code: e4; Body/Shell Style: PLUG; Contact Gender: Male; Mounting Style: STRAIGHT; Number of Rows Loaded: 1; PCB Contact Pattern: RECTANGULAR; Termination: Solder; Body Breadth: 0.1inch; Body Depth: 0.1inch; Mating Contact Pitch: 0.1inch; Mounting Option 1: LOCKING; Terminal Length: 0.118inch; Terminal Pitch: 2.54mm; Reach SVHC Compliant: Yes; RoHS Compliant: Yes; ComponentLink1URL: https://datasheet.ciiva.com:443/pdfs/VipMasterIC/IC/MIDC/MIDCS07676/MIDCS07676-1.pdf?src-supplier=IHS+Markit; ComponentLink1Description: https://datasheet.ciiva.com:443/pdfs/VipMasterIC/IC/MIDC/MIDCS07676/MIDCS07676-1.pdf?src-supplier=IHS+Markit; ComponentLink2URL: http://www.farnell.com/cad/1737268.pdf?src-supplier=Element14; ComponentLink2Description: http://www.farnell.com/cad/1737268.pdf?src-supplier=Element14; ComponentLink3URL: https://datasheet.octopart.com/61300511121-W%C3%BCrth-Elektronik-datasheet-21154836.pdf?src-supplier=Element14; ComponentLink3Description: https://datasheet.octopart.com/61300511121-W%C3%BCrth-Elektronik-datasheet-21154836.pdf?src-supplier=Element14; ComponentLink4URL: https://katalog.we-online.de/em/datasheet/6130xx11121.pdf?src-supplier=Digikey; ComponentLink4Description: https://katalog.we-online.de/em/datasheet/6130xx11121.pdf?src-supplier=Digikey
R4-R6 = RES_0805: SMD size 0805 Generic.; Manufacturer: *; Manufacture Part N: *; Tolerence: *; Package Size: *; Voltage Rating: *

## Sheet PWU.SchDoc
size A; SheetNumber: 4; SheetTotal: 5
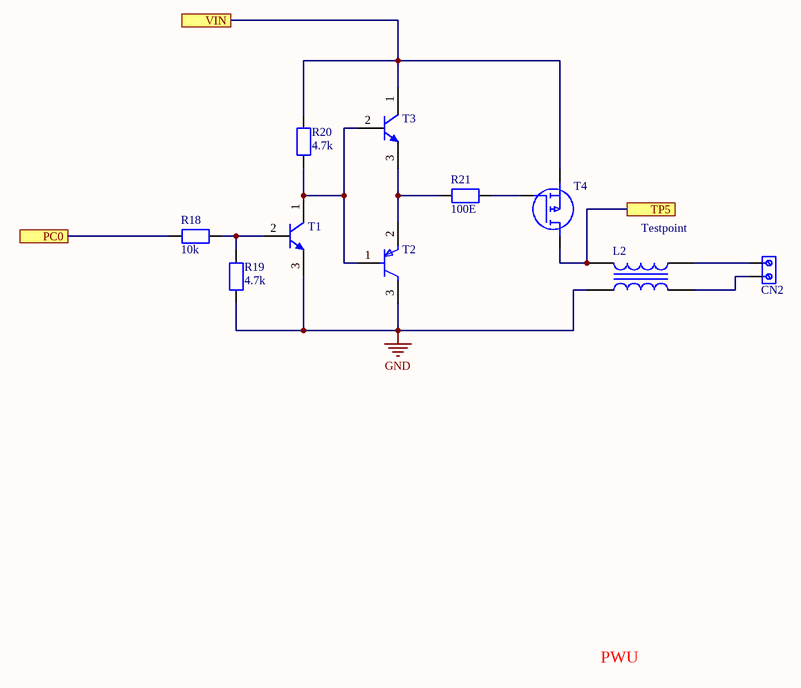
[diagram p3: PWU.SchDoc]

### Parts
CN2  connecters 2pins  [conncecto 2 pins]  (value not drawn)
L2  CM2545X171R-10  [LIRD-CM2545X171R-10_V]  (value not drawn)
R18  10k  [RES_0805]
R19  4.7k  [RES_0805]
R20  4.7k  [RES_0805]
R21  100E  [RES_0805]
T1  BC547CG  [ONSC-TO-92-3-29-11]  (value not drawn)
T2  BCV26  [FP-318-IPC_C]  (value not drawn)
T3  BC547CG  [ONSC-TO-92-3-29-11]  (value not drawn)
T4  Mosfet  [TO254P469X1042X1967-3P]  (value not drawn)

### Ports
PC0 (see CPU[4C]), TP5, VIN (see PowerSupply[3C])

### Nets
GND: L2.2 R19.1 T1.3(E) T2.3(C)  [project net +5]
NetCN2_1: CN2.1 L2.4
NetCN2_2: CN2.2 L2.3
NetCN7_1: R20.2 T3.1(C) T4.2(S) ; port VIN
NetIC1_1: R18.1 ; port PC0
NetL2_1: L2.1 T4.3(D) ; port TP5
NetR18_2: R18.2 R19.2 T1.2(B)
NetR20_1: R20.1 T1.1(C) T2.1(B) T3.2(B)
NetR21_1: R21.1 T2.2(E) T3.3(E)
NetR21_2: R21.2 T4.1(G)

### Notes on the sheet
- (near L2) Testpoint
- PWU

### Library data of the parts
CN2 = pins: printkroonsteen 5,08 mm,
L2 = CM2545X171R-10: Data Line Filter, 2 Function(s), 10A, 4 Pin(s); Manufacturer: Laird; DC Resistance-Max: 10mR; Channels: 2; Output Impedance: 170R; Supplier: Avnet; Supplier Part Number: CM2545X171R-10; Manufacturer Part Number: CM2545X171R-10; RoHS: Yes; Category: Common Mode Chokes; Stock: 12000; Pricing: 400=1.14668, 800=1.12312, 1600=1.09956, 2400=1.076, 3200=1.05244, 4000=1.02887, 40000=0.70911 (USD); Mounting Technology: Surface Mount; Terminal Finish: Nickel; Filter Type: DATA LINE FILTER; Current Rating: 10A; JESD-609 Code: e3; Length: 11.38mm; Width: 6.3mm; Height: 9.32mm; RoHS Compliant: Yes; Reach SVHC Compliant: Yes; ComponentLink1URL: https://datasheet.ciiva.com:443/pdfs/VipMasterIC/IC/LATE/LATES02109/LATES02109-1.pdf?src-supplier=IHS+Markit; ComponentLink1Description: https://datasheet.ciiva.com:443/pdfs/VipMasterIC/IC/LATE/LATES02109/LATES02109-1.pdf?src-supplier=IHS+Markit
R18-R21 = RES_0805: SMD size 0805 Generic.; Manufacturer: *; Manufacture Part N: *; Tolerence: *; Package Size: *; Voltage Rating: *
T1 T3 = BC547CG: as T5 on sheet PowerSupply; Supplier: Arrow Electronics; Supplier Part Number: BC547CG; Manufacturer Part Number: BC547CG; RoHS: Yes; Category: BJTs; Stock: 41483; Pricing: 1=0.214, 25=0.189, 100=0.169, 500=0.16, 1000=0.107, 2500=0.092, 5000=0.08, 10000=0.064, 25000=0.062 (USD); Pins: 3; Package Shape: Round; Terminal Finish: Copper; Transistor Element Material: SILICON; Max Operating Temperature: 150°C; JESD-609 Code: e1; Polarity/Channel Type: NPN; Collector-emitter Voltage-Max: 45V; JESD-30 Code: O-PBCY-T3; Package Style: CYLINDRICALMeter; Peak Reflow Temperature (Cel): 260°C; Terminal Form: Through Hole; Terminal Position: BOTTOM; RoHS Compliant: Yes; Reach SVHC Compliant: Yes; JEDEC-95 Code: TO-92; ComponentLink1URL: https://datasheet.ciiva.com:443/pdfs/VipMasterIC/IC/ONSM/ONSMS24464/ONSMS24464-1.pdf?src-supplier=IHS+Markit; ComponentLink1Description: https://datasheet.ciiva.com:443/pdfs/VipMasterIC/IC/ONSM/ONSMS24464/ONSMS24464-1.pdf?src-supplier=IHS+Markit; ComponentLink2URL: https://datasheet.ciiva.com/977/bc546-d-977051.pdf?src-supplier=Digikey; ComponentLink2Description: https://datasheet.ciiva.com/977/bc546-d-977051.pdf?src-supplier=Digikey
T2 = BCV26: Small Signal Bipolar Transistor, 1.2A I(C), 30V V(BR)CEO, 1-Element, PNP, Silicon; Manufacturer: ON Semiconductor / Fairchild; Package Body Material: Plastic; DC Current Gain-Min (hFE): 20000; Number of Elements: 1; Power Dissipation-Max (Abs): 300mW; Frequency: 220MHz; Qualification Status: Not Qualified; Supplier: Future Electronics; Supplier Part Number: 8096588; Manufacturer Part Number: BCV26; RoHS: Yes; Category: BJTs; Stock: 27000; Pricing: 3000=0.0435, 9000=0.0419, 15000=0.0412, 60000=0.0393, 90000=0.0381 (USD); Pins: 3; Package Shape: Rectangular; Transistor Element Material: SILICON; Max Operating Temperature: 150°C; Polarity/Channel Type: PNP; Max Collector Current: 1.2A; Collector-emitter Voltage-Max: 30V; JESD-30 Code: R-PDSO-G3; Package Style: SMALL OUTLINEMeter; Surface Mount: Yes; Terminal Form: Gull Wing; Terminal Position: DUAL; Moisture Sensitivity Level: 1; Reach SVHC Compliant: Yes; RoHS Compliant: Yes; ComponentLink1URL: https://datasheet.ciiva.com:443/pdfs/VipMasterIC/IC/ONSM/ONSM-S-A0003590120/ONSM-S-A0003585143-1.pdf?src-supplier=IHS+Markit; ComponentLink1Description: https://datasheet.ciiva.com:443/pdfs/VipMasterIC/IC/ONSM/ONSM-S-A0003590120/ONSM-S-A0003585143-1.pdf?src-supplier=IHS+Markit; ComponentLink2URL: https://datasheet.ciiva.com/5770/276230-5770438.pdf?src-supplier=Avnet; ComponentLink2Description: https://datasheet.ciiva.com/5770/276230-5770438.pdf?src-supplier=Avnet; ComponentLink3URL: https://datasheet.ciiva.com/5770/276230-5770438.pdf?src-supplier=Farnell; ComponentLink3Description: https://datasheet.ciiva.com/5770/276230-5770438.pdf?src-supplier=Farnell; ComponentLink4URL: https://datasheet.ciiva.com/4458/bcv26-104632-4458944.pdf?src-supplier=Mouser; ComponentLink4Description: https://datasheet.ciiva.com/4458/bcv26-104632-4458944.pdf?src-supplier=Mouser; ComponentLink5URL: https://datasheet.ciiva.com/7972/276230-7972620.pdf?src-supplier=Element14; ComponentLink5Description: https://datasheet.ciiva.com/7972/276230-7972620.pdf?src-supplier=Element14; ComponentLink6URL: https://datasheet.ciiva.com/7972/276230-7972621.pdf?src-supplier=Element14; ComponentLink6Description: https://datasheet.ciiva.com/7972/276230-7972621.pdf?src-supplier=Element14; ComponentLink7URL: https://datasheet.ciiva.com/6360/bcv26-6360908.pdf?src-supplier=Digikey; ComponentLink7Description: https://datasheet.ciiva.com/6360/bcv26-6360908.pdf?src-supplier=Digikey; ComponentLink8URL: https://datasheet.ciiva.com/6360/bcv26-6360909.pdf?src-supplier=Digikey; ComponentLink8Description: https://datasheet.ciiva.com/6360/bcv26-6360909.pdf?src-supplier=Digikey; ComponentLink9URL: https://datasheet.ciiva.com/6360/bcv26-6360911.pdf?src-supplier=Digikey; ComponentLink9Description: https://datasheet.ciiva.com/6360/bcv26-6360911.pdf?src-supplier=Digikey
T4 = Mosfet: Mosfet Transistor, IRF9Z34NPBF, generic.

## Sheet TermoCouple.SchDoc
size A; SheetNumber: 5; SheetTotal: 5
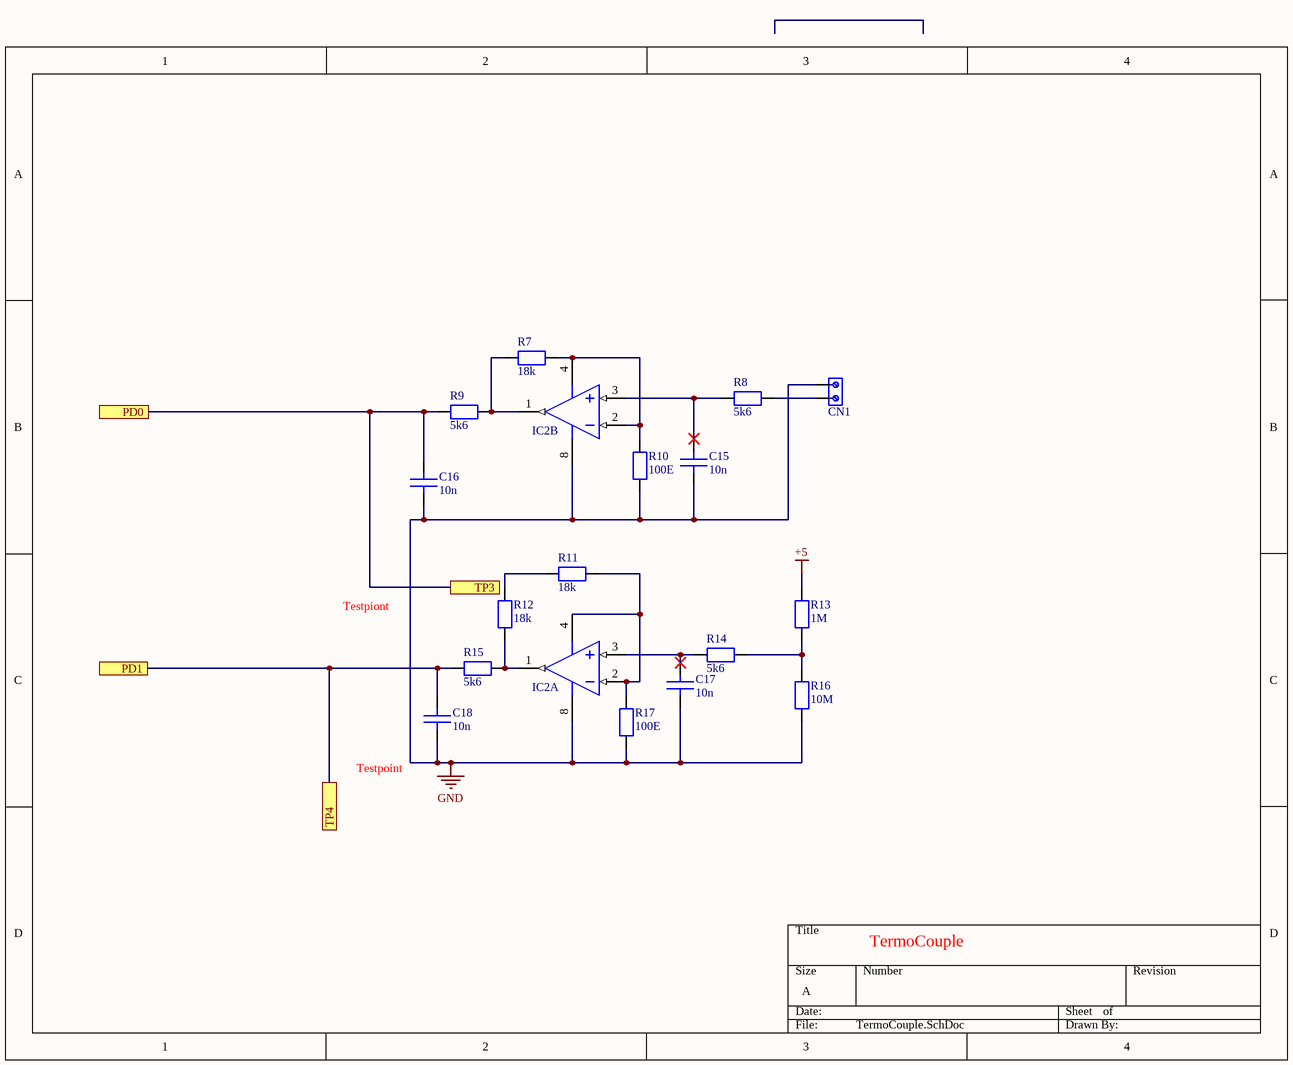
[diagram p4: TermoCouple.SchDoc]

### Parts
C15  10n  [CAP_0805]
C16  10n  [CAP_0805]
C17  10n  [CAP_0805]
C18  10n  [CAP_0805]
CN1  connecters 2pins  [conncecto 2 pins]  (value not drawn)
IC2A  MCP6002-E/P  [PDIP300-P8]  (value not drawn)
IC2B  MCP6002-E/P  [PDIP300-P8]  (value not drawn)
R7  18k  [RES_0805]
R8  5k6  [RES_0805]
R9  5k6  [RES_0805]
R10  100E  [RES_0805]
R11  18k  [RES_0805]
R12  18k  [RES_0805]
R13  1M  [RES_0805]
R14  5k6  [RES_0805]
R15  5k6  [RES_0805]
R16  10M  [RES_0805]
R17  100E  [RES_0805]

### Ports
PD0 (see CPU[1B]), PD1 (see CPU[1B]), TP3, TP4

### Nets
+5: C15.1 C16.2 C17.2 C18.1 CN1.1 IC2A.8(VDD) IC2B.8(VDD) R10.1 R13.2 R16.1 R17.1  [also labelled GND]
NetC15_2: C15.2 IC2B.3(VINA+) R8.1
NetC16_1: C16.1 R9.1 ; port PD0, port TP3
NetC17_1: C17.1 IC2A.3(VINA+) R14.1
NetC18_2: C18.2 R15.1 ; port PD1, port TP4
NetCN1_2: CN1.2 R8.2
NetIC2A_1: IC2A.1(VOUTA) R12.1 R15.2
NetIC2A_2: IC2A.2(VINA-) IC2A.4(VSS) R11.2 R17.2
NetIC2B_1: IC2B.1(VOUTA) R7.1 R9.2
NetIC2B_2: IC2B.2(VINA-) IC2B.4(VSS) R7.2 R10.2
NetR11_1: R11.1 R12.2
NetR13_1: R13.1 R14.2 R16.2

### Notes on the sheet
- Testpiont
- (near C18) Testpoint
- TermoCouple

### Library data of the parts
C15-C18 = CAP_0805: Capacitor SMD 0805 generic.; Manufacturer: *; Manufacture Part N: *; Tolerence: *; Voltage Rating: *; Dielectric: *
CN1 = pins: printkroonsteen 5,08 mm,
IC2A IC2B = MCP6002-E/P: Operational Amplifier, 2 Func, 4500uV Offset-Max, CMOS, PDIP8; Manufacturer: Microchip; Package Body Material: Plastic; Architecture: VOLTAGE-FEEDBACK; Common-mode Reject Ratio-Nom: 76dB; Frequency Compensation: YES; Input Offset Voltage-Max: 4.5mV; Low-Bias: No; Channels: 2; Package Equivalence Code: SOLCC8,.11,20; Power Supplies: 2.5V; Slew Rate: 0.6V/µs; Max Supply Current: 340uA; Supply Voltage Limit-Max: 7V; Nominal Supply Voltage: 5V; Surface Mount: No; Unity Gain BW-Nom: 1MHz; Voltage Gain-Min: 25110; Qualification Status: Not Qualified; Supplier: Avnet; Supplier Part Number: 88H9855; Manufacturer Part Number: MCP6002-E/P; RoHS: Yes; Category: Amplifiers - Op Amps, Buffer, Instrumentation; Stock: 25; Pricing: 1=0.377 (USD); Case/Package: DIP; Pins: 8; Package Shape: Rectangular; Terminal Finish: Tin; Min Operating Temperature: -40°C; Max Operating Temperature: 125°C; JESD-609 Code: e3; Amplifier Type: OPERATIONAL AMPLIFIER; JESD-30 Code: R-PDIP-T8; Low-Offset: No; Micropower: Yes; Package Style: IN-LINEMeter; Power: No; Programmable Power: No; Technology: CMOS; Terminal Form: Through Hole; Terminal Position: DUAL; Wideband: No; Length: 9.271mm; Width: 7.62mm; Height - Seated (Max): 5.33mm; Terminal Pitch: 2.54mm; Temperature Grade: AUTOMOTIVE; Reach SVHC Compliant: Yes; RoHS Compliant: Yes; ComponentLink1URL: https://datasheet.ciiva.com:443/pdfs/VipMasterIC/IC/MCHP/MCHP-S-A0010037088/MCHP-S-A0010037127-1.pdf?src-supplier=IHS+Markit; ComponentLink1Description: https://datasheet.ciiva.com:443/pdfs/VipMasterIC/IC/MCHP/MCHP-S-A0010037088/MCHP-S-A0010037127-1.pdf?src-supplier=IHS+Markit; ComponentLink2URL: https://datasheet.ciiva.com/19474/1285888-19474433.pdf?src-supplier=Jameco; ComponentLink2Description: https://datasheet.ciiva.com/19474/1285888-19474433.pdf?src-supplier=Jameco; ComponentLink3URL: https://datasheet.ciiva.com/26922/getdatasheetpartid-772743-26922641.pdf?src-supplier=Verical; ComponentLink3Description: https://datasheet.ciiva.com/26922/getdatasheetpartid-772743-26922641.pdf?src-supplier=Verical; ComponentLink4URL: https://datasheet.ciiva.com/16347/filehandler-aspxddocname-en011705-16347733.pdf?src-supplier=Future+Electronics; ComponentLink4Description: https://datasheet.ciiva.com/16347/filehandler-aspxddocname-en011705-16347733.pdf?src-supplier=Future+Electronics; ComponentLink5URL: https://datasheet.ciiva.com/7653/524878-7653495.pdf?src-supplier=Element14; ComponentLink5Description: https://datasheet.ciiva.com/7653/524878-7653495.pdf?src-supplier=Element14; ComponentLink6URL: https://datasheet.ciiva.com/14151/bsmicrochip-op-verstaerker-mcp600-en-14151451.pdf?src-supplier=Distrelec; ComponentLink6Description: https://datasheet.ciiva.com/14151/bsmicrochip-op-verstaerker-mcp600-en-14151451.pdf?src-supplier=Distrelec; ComponentLink7URL: https://datasheet.ciiva.com/11706/jp011705-11706855.pdf?src-supplier=Avnet; ComponentLink7Description: https://datasheet.ciiva.com/11706/jp011705-11706855.pdf?src-supplier=Avnet; ComponentLink8URL: https://datasheet.ciiva.com/1802/21733j-1802727.pdf?src-supplier=Digikey; ComponentLink8Description: https://datasheet.ciiva.com/1802/21733j-1802727.pdf?src-supplier=Digikey; ComponentLink9URL: https://datasheet.ciiva.com/4758/21733e-41017-4758151.pdf?src-supplier=Mouser; ComponentLink9Description: https://datasheet.ciiva.com/4758/21733e-41017-4758151.pdf?src-supplier=Mouser
R7-R17 = RES_0805: SMD size 0805 Generic.; Manufacturer: *; Manufacture Part N: *; Tolerence: *; Package Size: *; Voltage Rating: *

## Nets that join several sheets
+5: CPU (27 pins), PowerSupply (15 pins), PWU (L2.2 R19.1 T1.3 T2.3), TermoCouple (11 pins)
NetC16_1: CPU (IC1.9), TermoCouple (C16.1 R9.1)
NetC18_2: CPU (IC1.10), TermoCouple (C18.2 R15.1)
NetCN7_1: PowerSupply (CN7.1 F1.1 R24.1 RE1.11), PWU (R20.2 T3.1 T4.2)
NetIC1_1: CPU (IC1.1), PWU (R18.1)
NetIC1_11: CPU (IC1.11), PowerSupply (ZD1.3)
NetIC1_19: CPU (IC1.19), PowerSupply (R23.2)
NetIC1_36: CPU (IC1.36 J1B.4 R1.1), Display (J9B.4)